# Altium schematic sheet Debugger.SchDoc
size A4; SheetNumber: 3; SheetTotal: 3
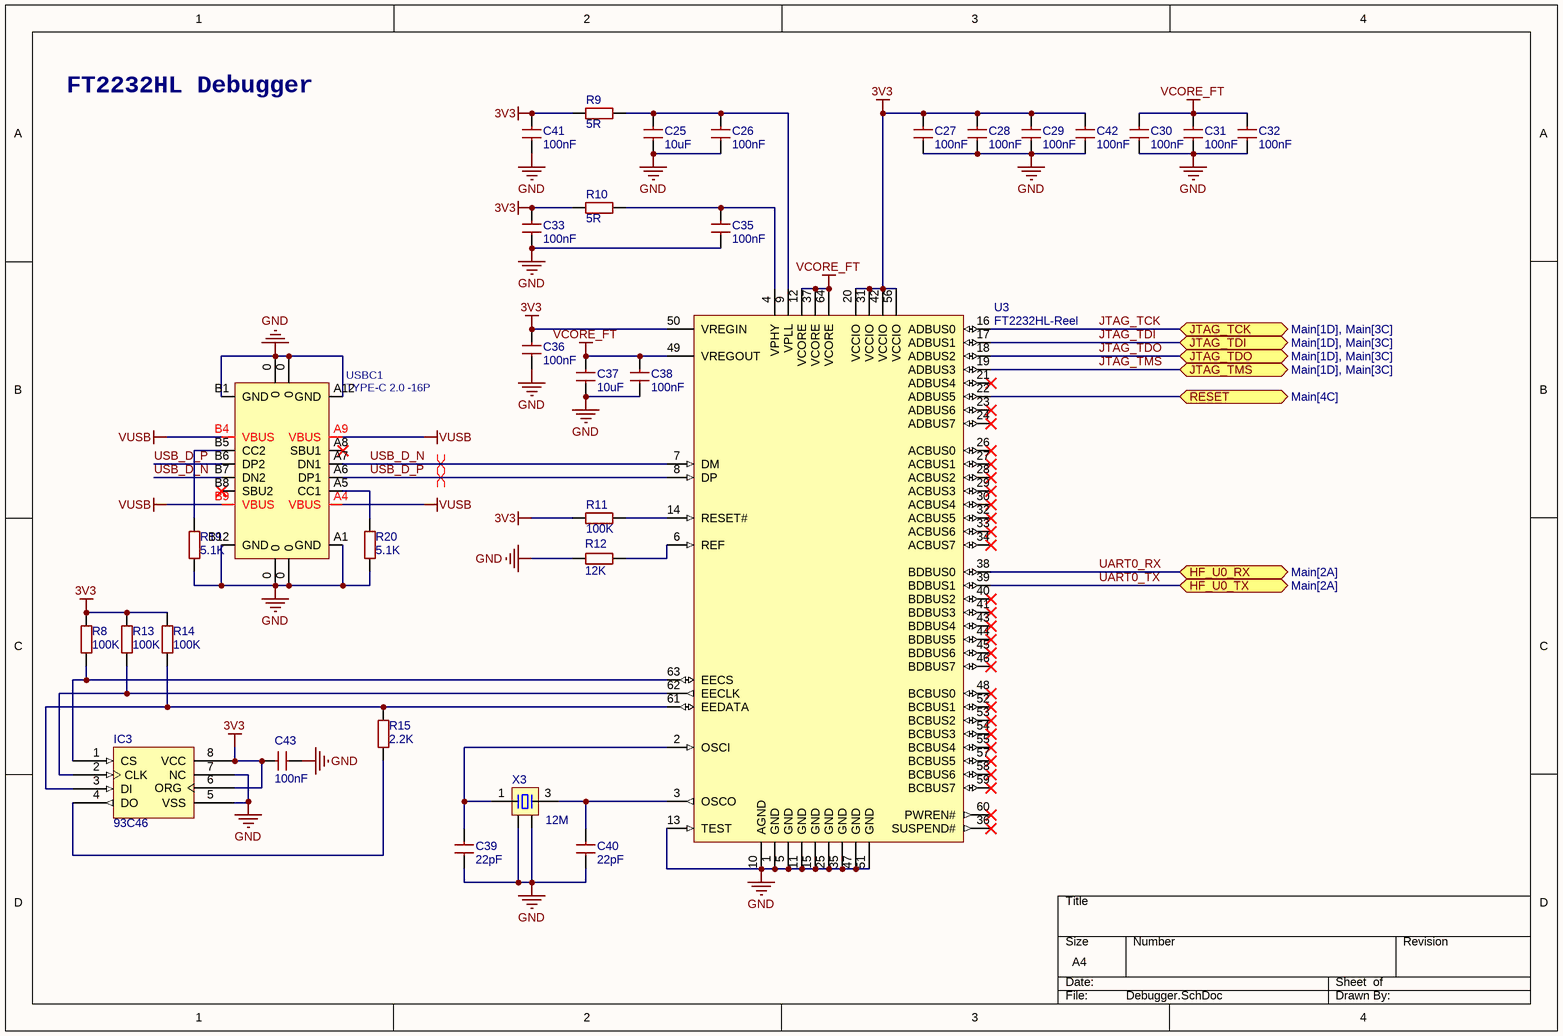
[diagram p0: Debugger.SchDoc]

## Parts
C25  10uF  [C0603_NS]
C26  100nF  [C0603_NS]
C27  100nF  [C0603_NS]
C28  100nF  [C0603_NS]
C29  100nF  [C0603_NS]
C30  100nF  [C0603_NS]
C31  100nF  [C0603_NS]
C32  100nF  [C0603_NS]
C33  100nF  [C0603_NS]
C35  100nF  [C0603_NS]
C36  100nF  [C0603_NS]
C37  10uF  [C0603_NS]
C38  100nF  [C0603_NS]
C39  22pF  [C0603_NS]
C40  22pF  [C0603_NS]
C41  100nF  [C0603_NS]
C42  100nF  [C0603_NS]
C43  100nF  [C0603_NS]
IC3  93C46  [SOP8_L]
R8  100K  [R0603_NS]
R9  5R  [R0603_NS]
R10  5R  [R0603_NS]
R11  100K  [R0603_NS]
R12  12K  [R0603_NS]
R13  100K  [R0603_NS]
R14  100K  [R0603_NS]
R15  2.2K  [R0603_NS]
R19  5.1K  [R0603_NS]
R20  5.1K  [R0603_NS]
U3  FT2232HL-Reel  [LQFP-64_M]
USBC1  TYPE-C 2.0 -16P  [USB-C-SMD_16P]
X3  12M  [XTAL-2025-4P]

## Ports
HF_U0_RX (bidir, see Main[2A]), HF_U0_TX (bidir, see Main[2A]), JTAG_TCK (bidir, see Main[1D], Main[3C]), JTAG_TDI (bidir, see Main[1D], Main[3C]), JTAG_TDO (bidir, see Main[1D], Main[3C]), JTAG_TMS (bidir, see Main[1D], Main[3C]), RESET (bidir, see Main[4C])

## Nets
3V3: C27.2 C28.2 C29.2 C33.2 C36.2 C41.2 C42.2 C43.1 IC3.6(ORG) IC3.8(VCC) R8.2 R9.2 R10.2 R11.2 R13.2 R14.2 U3.20(VCCIO) U3.31(VCCIO) U3.42(VCCIO) U3.50(VREGIN) U3.56(VCCIO)
GND: C25.1 C26.1 C27.1 C28.1 C29.1 C30.1 C31.1 C32.1 C33.1 C35.1 C36.1 C37.1 C38.1 C39.1 C40.1 C41.1 C42.1 C43.2 IC3.5(VSS) IC3.7(NC) R12.1 R19.1 R20.1 U3.1(GND) U3.5(GND) U3.10(AGND) U3.11(GND) U3.13(TEST) U3.15(GND) U3.25(GND) U3.35(GND) U3.47(GND) U3.51(GND) USBC1.0 USBC1.A1(GND) USBC1.A12(GND) USBC1.B1(GND) USBC1.B12(GND) X3.2 X3.4
VCORE_FT: C30.2 C31.2 C32.2 C37.2 C38.2 U3.12(VCORE) U3.37(VCORE) U3.49(VREGOUT) U3.64(VCORE)
VUSB: USBC1.A4(VBUS) USBC1.A9(VBUS) USBC1.B4(VBUS) USBC1.B9(VBUS)
JTAG_TCK: U3.16(ADBUS0) ; port JTAG_TCK
JTAG_TDI: U3.17(ADBUS1) ; port JTAG_TDI
JTAG_TDO: U3.18(ADBUS2) ; port JTAG_TDO
JTAG_TMS: U3.19(ADBUS3) ; port JTAG_TMS
RESET: U3.22(ADBUS5) ; port RESET
UART0_RX: U3.38(BDBUS0) ; port HF_U0_RX
UART0_TX: U3.39(BDBUS1) ; port HF_U0_TX
USB_D_N: U3.7(DM) USBC1.A7(DN1) USBC1.B7(DN2)
USB_D_P: U3.8(DP) USBC1.A6(DP1) USBC1.B6(DP2)
NetC25_2: C25.2 C26.2 R9.1 U3.9(VPLL)
NetC35_2: C35.2 R10.1 U3.4(VPHY)
NetC39_2: C39.2 U3.2(OSCI) X3.1
NetC40_2: C40.2 U3.3(OSCO) X3.3
NetIC3_1: IC3.1(CS) R8.1 U3.63(EECS)
NetIC3_2: IC3.2(CLK) R13.1 U3.62(EECLK)
NetIC3_3: IC3.3(DI) R14.1 R15.1 U3.61(EEDATA)
NetIC3_4: IC3.4(DO) R15.2
NetR11_1: R11.1 U3.14(RESET#)
NetR12_2: R12.2 U3.6(REF)
NetR19_2: R19.2 USBC1.B5(CC2)
NetR20_2: R20.2 USBC1.A5(CC1)

Not connected (* = marked no-connect by the designer): U3 21(ADBUS4)* 23(ADBUS6)* 24(ADBUS7)* 26(ACBUS0)* 27(ACBUS1)* 28(ACBUS2)* 29(ACBUS3)* 30(ACBUS4)* 32(ACBUS5)* 33(ACBUS6)* 34(ACBUS7)* 36(SUSPEND#)* 40(BDBUS2)* 41(BDBUS3)* 43(BDBUS4)* 44(BDBUS5)* 45(BDBUS6)* 46(BDBUS7)* 48(BCBUS0)* 52(BCBUS1)* 53(BCBUS2)* 54(BCBUS3)* 55(BCBUS4)* 57(BCBUS5)* 58(BCBUS6)* 59(BCBUS7)* 60(PWREN#)*; USBC1 A8(SBU1)* B8(SBU2)*

## Layout directives
differential pair: USB_D_N, USB_D_P

## Notes on the sheet
- FT2232HL Debugger

## Library data of the parts
C25-C33 C35-C43 = C: 贴片电容/MLCC电容; BOM名称: 无极性贴片电容; 联系卖家，免费查找封装: 唯一出售店铺网址https://shop463601444.taobao.com
IC3 = 93C46: 外置EEPROM; 联系卖家 免费查找封装: 唯一出售店铺网址https://shop463601444.taobao.com; BOM名称: 外置EEPROM
R8-R15 R19 R20 = R: 贴片电阻; 联系卖家，免费查找封装: 唯一出售店铺网址https://shop463601444.taobao.com; BOM名称: 贴片电阻
U3 = CMP-0078-00023-3: Dual High Speed USB To Multipurpose UART/FIFO IC, 64-pin LQFP, Tape and Reel; Manufacturer: FTDI; DatasheetVersion: ver 2.21, Jun-2012; ComponentLink1URL: http://www.ftdichip.com/; PartNumber: FT2232HL-Reel; ComponentLink2Description: Datasheet; RevisionNote: DatasheetVersion updated to 2.21 Jun-2012; PackageVersion: Jun-12; ComponentLink1Description: Manufacturer URL; ComponentLink2URL: http://www.ftdichip.com/Support/Documents/DataSheets/ICs/DS_FT2232H.pdf; PackageReference: LQFP-64; PackageDescription: 64-Pin Thin Quad Flat Pack, 10 x 10 x 1.4 mm Body, 0.5 mm Pitch
USBC1 = USB2.0_Type-C_16Pin: USB2.0_Type-C_16Pin母座; 联系卖家 免费技术支持: 封装库来自淘宝卖家ID：黄晶宝石
X3 = XTAL-4P: 4脚无源晶振(谐振器）; 联系卖家，免费查找封装: 唯一出售店铺网址https://shop463601444.taobao.com; BOM名称: 4脚无源晶振(谐振器）